# Altium project PT100.PrjPcb
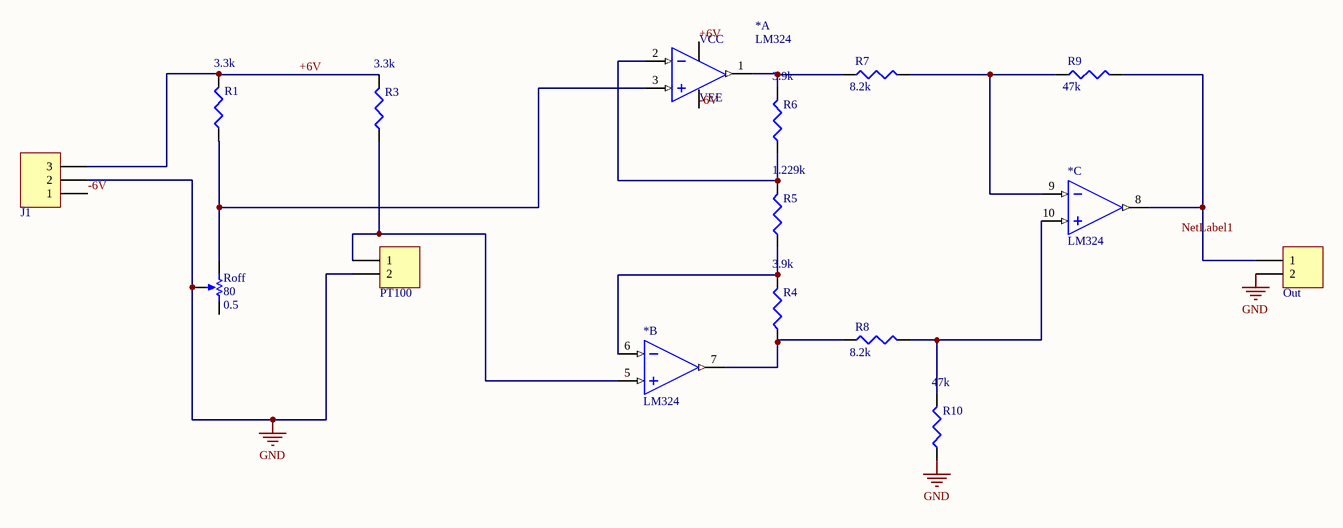
[diagram p0: PT100.SchDoc]
Author: Jean Vanneste; Title: PT100 control card
1 sheet, 16 parts. Net scope: global (net labels, ports and power ports of the same name join across sheets).
Board file: PT100.PcbDoc

## Sheet PT100.SchDoc: PT100 control card
size A4

### Parts
(Parts that share a designator on the sheet are numbered #1, #2 ... from top to bottom, then left to right.)
*#1  LM324  [DIP14]  (part A of 4)
*#2  LM324  [DIP14]  (part C of 4)
*#3  LM324  [DIP14]  (part B of 4)
J1  Connecteur 3  [ALIM3]  (value not drawn)
Out  Connecteur 2  [ALIM2]  (value not drawn)
PT100  Connecteur 2  [ALIM2]  (value not drawn)
R1  3.3k  [AXIAL-0.4]
R3  3.3k  [AXIAL-0.4]
R4  3.9k  [AXIAL-0.4]
R5  1.229k  [AXIAL-0.4]
R6  3.9k  [AXIAL-0.4]
R7  8.2k  [AXIAL-0.4]
R8  8.2k  [AXIAL-0.4]
R9  47k  [AXIAL-0.4]
R10  47k  [AXIAL-0.4]
Roff  80  Set Position: 0.5  [VARRES]

### Nets
GND: J1.2 Out.2 PT100.2 R10.1 Roff.3(TAP)
+6V: *#1.4(VCC) J1.3 R1.2 R3.2
-6V: *#1.11(VEE) J1.1
Net*#1_1: *#1.1(OUT) R6.2 R7.1
Net*#1_2: *#1.2(-IN) R5.2 R6.1
Net*#1_3: *#1.3(+IN) R1.1 Roff.1(TOP)
Net*#2_8: *#2.8(OUT) Out.1 R9.2
Net*#2_9: *#2.9(-IN) R7.2 R9.1
Net*#2_10: *#2.10(+IN) R8.2 R10.2
Net*#3_5: *#3.5(+IN) PT100.1 R3.1
Net*#3_6: *#3.6(-IN) R4.2 R5.1
Net*#3_7: *#3.7(OUT) R4.1 R8.1

Not connected (* = marked no-connect by the designer): Roff 2(BOT)

### Notes on the sheet
- Labels drawn without touching a wire or pin: NetLabel1

### Library data of the parts
*#1-*#3 = LM324: 4 Ampli Op
J1 = Connecteur 3: Connecteur; Designer: ECAM 2004; Type: Connecteur à vis
Out PT100 = Connecteur 2: Connecteur; Designer: ECAM 2005; Type: Connecteur à vis
R1 R3-R10 = Résistance: Résistance standard; Designer: ECAM 2005; Type: Résistance standard
Roff = Potentiomètre: Designer: ECAM 2002; Type: Résistance variable